# Altium schematic sheet Power_System.SchDoc
size A4; SheetNumber: 3; SheetTotal: 6
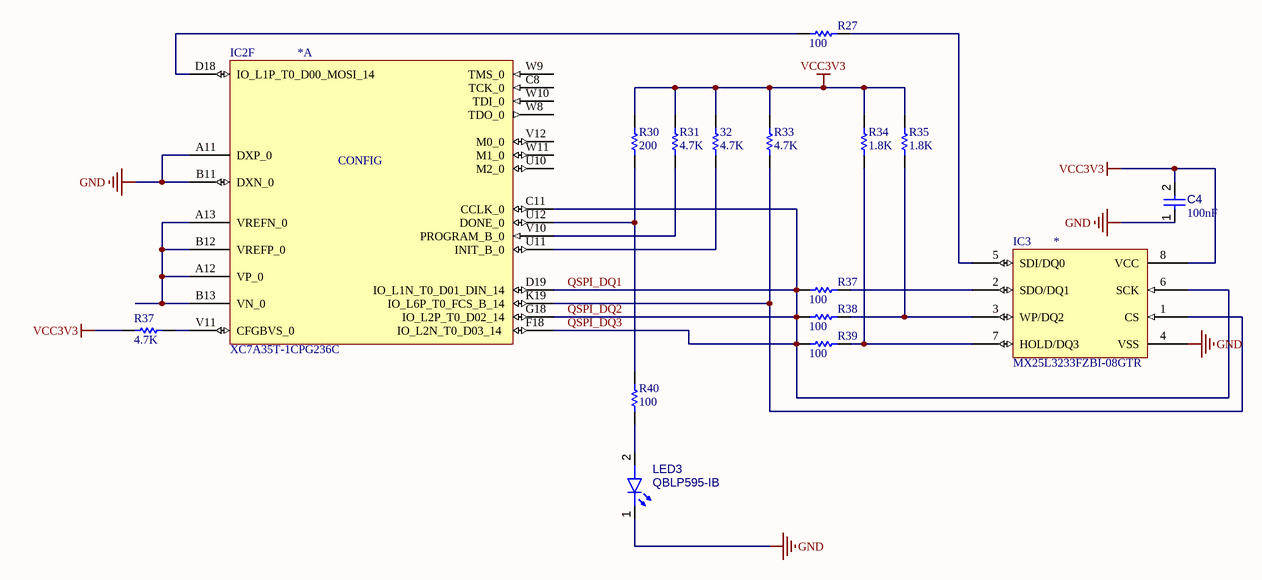
[diagram p0: Power_System.SchDoc]

## Parts
(Parts that share a designator on the sheet are numbered #1, #2 ... from top to bottom, then left to right.)
32  value 4.7K  [RESC1005X40X25ML05T10]  (hidden comment: Resistor 51k +/-5% 0402 63 mW)
*#1  XC7A35T-1CPG236C  [BGA81C50P19X19_1000X1000X110]  (part A of 3)
*#2  MX25L3233FZBI-08GTR  [SON127P500X80_HS-9N]
C4  value 100nF  [CAPC0402(1005)60_L]  (hidden comment: Capacitor 100nF +/-20% 10V 0402)
LED3  QBLP595-IB  [QTB-QBLP595_V]
R27  value 100  [RESC1005X40X25ML05T10]  (hidden comment: Resistor 51k +/-5% 0402 63 mW)
R30  value 200  [RESC1005X40X25ML05T10]  (hidden comment: Resistor 51k +/-5% 0402 63 mW)
R31  value 4.7K  [RESC1005X40X25ML05T10]  (hidden comment: Resistor 51k +/-5% 0402 63 mW)
R33  value 4.7K  [RESC1005X40X25ML05T10]  (hidden comment: Resistor 51k +/-5% 0402 63 mW)
R34  value 1.8K  [RESC1005X40X25ML05T10]  (hidden comment: Resistor 51k +/-5% 0402 63 mW)
R35  value 1.8K  [RESC1005X40X25ML05T10]  (hidden comment: Resistor 51k +/-5% 0402 63 mW)
R37#1  value 100  [RESC1005X40X25ML05T10]  (hidden comment: Resistor 51k +/-5% 0402 63 mW)
R37#2  value 4.7K  [RESC1005X40X25ML05T10]  (hidden comment: Resistor 51k +/-5% 0402 63 mW)
R38  value 100  [RESC1005X40X25ML05T10]  (hidden comment: Resistor 51k +/-5% 0402 63 mW)
R39  value 100  [RESC1005X40X25ML05T10]  (hidden comment: Resistor 51k +/-5% 0402 63 mW)
R40  value 100  [RESC1005X40X25ML05T10]  (hidden comment: Resistor 51k +/-5% 0402 63 mW)

## Nets
GND: *#1.A11(DXP_0) *#1.B11(DXN_0) *#2.4(VSS) C4.1 LED3.1(K)
VCC3V3: 32.2 *#2.8(VCC) C4.2 R30.2 R31.2 R33.2 R34.2 R35.2 R37#2.1
QSPI_DQ1: *#1.C11(CCLK_0) *#1.D19(IO_L1N_T0_D01_DIN_14) *#1.F18(IO_L2N_T0_D03_14) *#1.G18(IO_L2P_T0_D02_14) *#2.6(SCK) R37#1.1 R38.1 R39.1  [also labelled QSPI_DQ2, QSPI_DQ3]
Net32_1: 32.1 *#1.U11(INIT_B_0)
Net*#1_A12: *#1.A12(VP_0) *#1.A13(VREFN_0) *#1.B12(VREFP_0) *#1.B13(VN_0)
Net*#1_D18: *#1.D18(IO_L1P_T0_D00_MOSI_14) R27.1
Net*#1_K19: *#1.K19(IO_L6P_T0_FCS_B_14) *#2.1(CS) R33.1
Net*#1_U12: *#1.U12(DONE_0) R30.1 R40.2
Net*#1_V10: *#1.V10(PROGRAM_B_0) R31.1
Net*#1_V11: *#1.V11(CFGBVS_0) R37#2.2
Net*#2_2: *#2.2(SDO/DQ1) R37#1.2
Net*#2_3: *#2.3(WP/DQ2) R35.1 R38.2
Net*#2_5: *#2.5(SDI/DQ0) R27.2
Net*#2_7: *#2.7(HOLD/DQ3) R34.1 R39.2
NetLED3_2: LED3.2(A) R40.1

Not connected (* = marked no-connect by the designer): *#1 C8(TCK_0) U10(M2_0) V12(M0_0) W8(TDO_0) W9(TMS_0) W10(TDI_0) W11(M1_0)

## Notes on the sheet
- (in symbol CMP-020-00028-1) IC3
- (in symbol CMP-020-00032-2, part A) IC2F; CONFIG

## Library data of the parts
32 R27 R30 R31 R33-R35 R37#1 R37#2 R38-R40 = CMP-009-00000-5: Chip Resistor, 51 KOhm, +/- 5%, 0.063 W, -55 to 155 degC, 0402 (1005 Metric); Power: 63mW; Case/Package: 0402; Min Operating Temperature: -55°C; Mounting Technology: SM; RoHS Compliant: True; Max Operating Temperature: 155°C; Tolerance: 5%; Pins: 2
*#1 = CMP-020-00032-2: FPGA Artix-7 Family 33280 Cells 28nm Technology 1V 236-Pin CSBGA; Min Supply Voltage: 950mV; Max Supply Voltage: 1.05V; Clock Frequency: 1.098GHz; RAM Size: 225kB; Pins: 236; Max Operating Temperature: 85°C; Case/Package: LFBGA; Min Operating Temperature: 0°C
*#2 = CMP-020-00028-1: NOR Flash Serial-3Wire 3V 32Mbit 32M/16M/8M x 1Bit/2Bit/4Bit 8-Pin USON T/R
C4 = CMP-001-00061-3: Chip Capacitor, 100nF +/-20%, 10V, 0402, Thickness 0.6 mm; Tolerance: 20%; Mounting Technology: SMT; Voltage Rating: 10V; Max Operating Temperature: 85°C; Pins: 2; Case/Package: 0402; Min Operating Temperature: -55°C
LED3 = CMP-007-00042-3: Chip LED 0402, Blue, 0.02 A, 3.1 to 3.7 V, -40 to 80 degC, 2-Pin SMD, RoHS, Tape and Reel; RoHS Compliant: Yes; Colour: Blue; Pins: 2; Case/Package: 0402; Mounting Technology: SMT